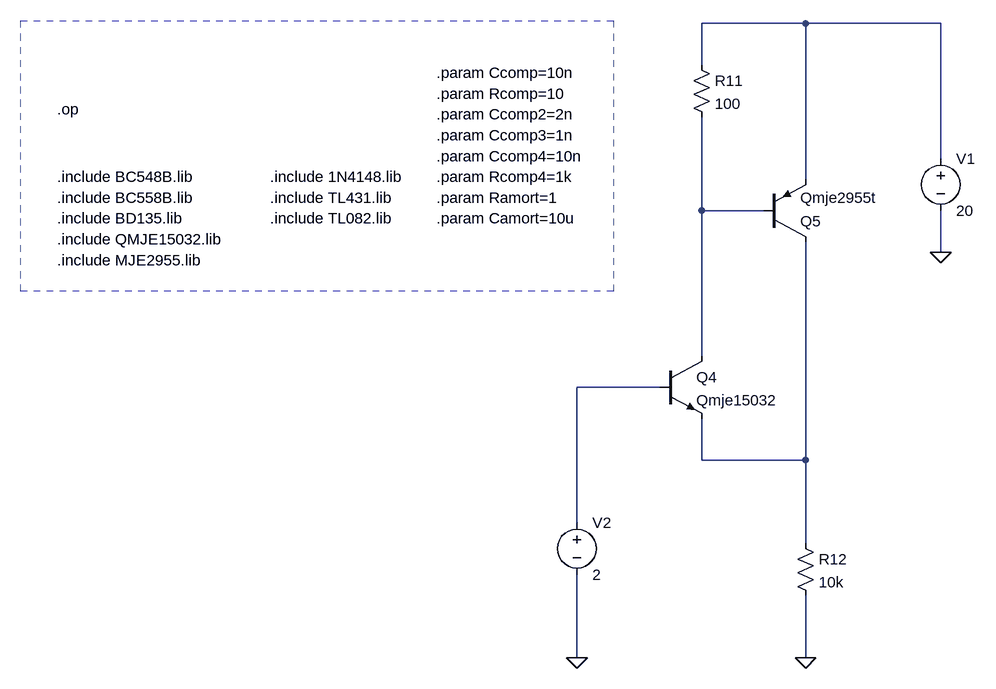
[diagram p0: schematic power_supply_P05.0.asc]
power_supply_P05.0.asc, the LTspice schematic file:
Version 4
SHEET 1 3040 1240
WIRE -384 -752 -544 -752
WIRE -176 -752 -384 -752
WIRE -544 -688 -544 -752
WIRE -384 -560 -384 -752
WIRE -176 -544 -176 -752
WIRE -384 -512 -384 -560
WIRE -544 -496 -544 -608
WIRE -544 -464 -544 -496
WIRE -448 -464 -544 -464
WIRE -176 -400 -176 -464
WIRE -384 -368 -384 -416
WIRE -544 -256 -544 -464
WIRE -544 -240 -544 -256
WIRE -608 -192 -736 -192
WIRE -384 -160 -384 -368
WIRE -544 -80 -544 -144
WIRE -384 -80 -384 -160
WIRE -384 -80 -544 -80
WIRE -736 16 -736 -192
WIRE -384 48 -384 -80
WIRE -736 224 -736 96
WIRE -384 224 -384 128
FLAG -176 -400 0
FLAG -384 224 0
FLAG -736 224 0
DATAFLAG -544 -496 ""
DATAFLAG -384 -160 ""
DATAFLAG -384 -368 "Ic(Q5)"
DATAFLAG -544 -256 "$"
DATAFLAG -384 -560 "$"
SYMBOL res -400 32 R0
SYMATTR InstName R12
SYMATTR Value 10k
SYMBOL pnp -448 -416 M180
SYMATTR InstName Q5
SYMATTR Value Qmje2955t
SYMBOL voltage -176 -560 R0
SYMATTR InstName V1
SYMATTR Value 20
SYMBOL res -560 -704 R0
SYMATTR InstName R11
SYMATTR Value 100
SYMBOL npn -608 -240 R0
SYMATTR InstName Q4
SYMATTR Value Qmje15032
SYMBOL voltage -736 0 R0
SYMATTR InstName V2
SYMATTR Value 2
TEXT -1536 -484 Left 2 !.include BC558B.lib
TEXT -1208 -452 Left 2 !.include TL082.lib
TEXT -1536 -516 Left 2 !.include BC548B.lib
TEXT -1536 -388 Left 2 !.include MJE2955.lib
TEXT -1536 -452 Left 2 !.include BD135.lib
TEXT -1208 -516 Left 2 !.include 1N4148.lib
TEXT -1208 -484 Left 2 !.include TL431.lib
TEXT -1536 -420 Left 2 !.include QMJE15032.lib
TEXT -1536 -620 Left 2 !.op
TEXT -952 -676 Left 2 !.param Ccomp=10n
TEXT -952 -644 Left 2 !.param Rcomp=10
TEXT -952 -612 Left 2 !.param Ccomp2=2n
TEXT -952 -580 Left 2 !.param Ccomp3=1n
TEXT -952 -548 Left 2 !.param Ccomp4=10n
TEXT -952 -484 Left 2 !.param Ramort=1
TEXT -952 -452 Left 2 !.param Camort=10u
TEXT -952 -516 Left 2 !.param Rcomp4=1k
RECTANGLE Normal -680 -340 -1592 -756 1

The netlist it stands for:
* power_supply_P05.0.asc
R12 N003 0 10k
Q5 N003 N002 N001 0 Qmje2955t
V1 N001 0 20
R11 N001 N002 100
Q4 N002 N004 N003 0 Qmje15032
V2 N004 0 2
.model NPN NPN
.model PNP PNP
.lib standard.bjt
.include BC558B.lib
.include TL082.lib
.include BC548B.lib
.include MJE2955.lib
.include BD135.lib
.include 1N4148.lib
.include TL431.lib
.include QMJE15032.lib
.op
.param Ccomp=10n
.param Rcomp=10
.param Ccomp2=2n
.param Ccomp3=1n
.param Ccomp4=10n
.param Ramort=1
.param Camort=10u
.param Rcomp4=1k
.backanno
.end